# Altium schematic sheet TOP.SchDoc
size A4
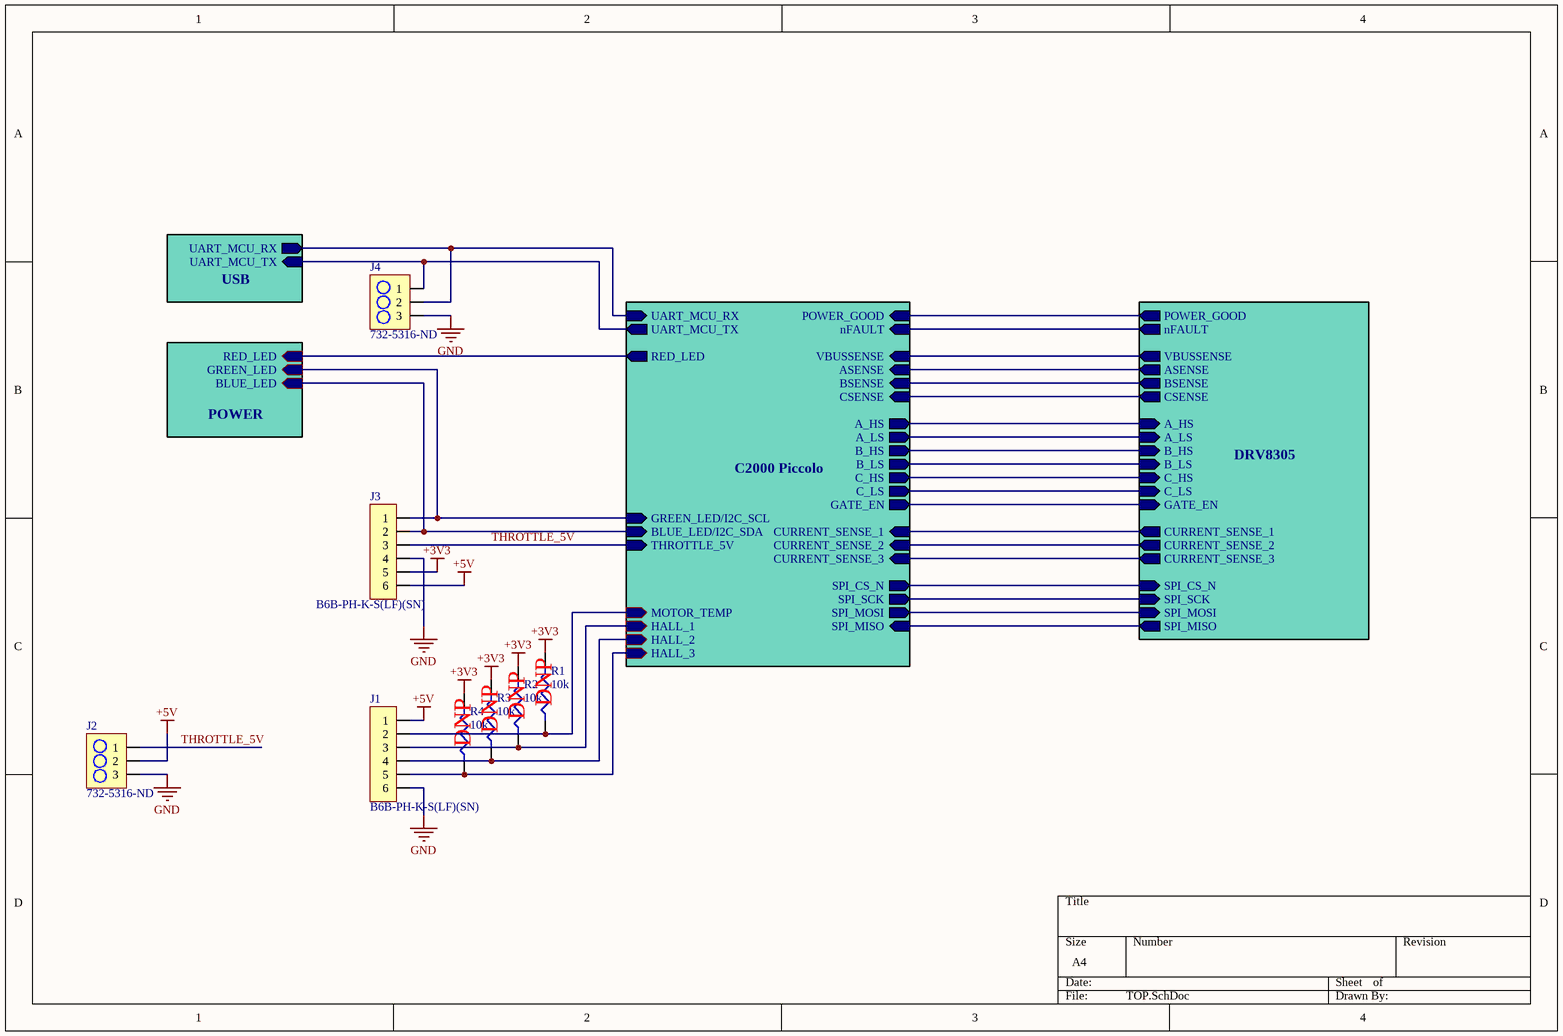
[diagram p0: TOP.SchDoc]

## Parts
J1  B6B-PH-K-S(LF)(SN)  [JST-PH-6]
J2  732-5316-ND  [3PIN_HEADER]
J3  B6B-PH-K-S(LF)(SN)  [JST-PH-6]
J4  732-5316-ND  [3PIN_HEADER]
R1  10k  [R0402]
R2  10k  [R0402]
R3  10k  [R0402]
R4  10k  [R0402]

## Sub-sheets
C2000 Piccolo = MCU.SchDoc: VBUSSENSE, ASENSE, BSENSE, CSENSE, A_HS, A_LS, B_HS, B_LS, C_HS, C_LS, GATE_EN, CURRENT_SENSE_1, CURRENT_SENSE_2, CURRENT_SENSE_3, SPI_CS_N, SPI_SCK, SPI_MOSI, SPI_MISO, POWER_GOOD, nFAULT, UART_MCU_RX, UART_MCU_TX, RED_LED, THROTTLE_5V, HALL_3, HALL_1, HALL_2, MOTOR_TEMP, BLUE_LED/I2C_SDA, GREEN_LED/I2C_SCL
DRV8305 = DRIVER.SchDoc: ASENSE, BSENSE, CSENSE, A_HS, A_LS, B_HS, B_LS, C_HS, C_LS, GATE_EN, SPI_CS_N, SPI_SCK, SPI_MOSI, SPI_MISO, nFAULT, POWER_GOOD, VBUSSENSE, CURRENT_SENSE_1, CURRENT_SENSE_2, CURRENT_SENSE_3
POWER = POWER.SchDoc: GREEN_LED, RED_LED, BLUE_LED
USB = USB.SchDoc: UART_MCU_RX, UART_MCU_TX

## Nets
+3V3: J3.5 R1.2 R2.2 R3.2 R4.2
+5V: J1.1 J2.2 J3.6
GND: J1.6 J2.3 J3.4 J4.3
THROTTLE_5V: J2.1 J3.3 ; sheet C2000 Piccolo/THROTTLE_5V
NetJ1_2: J1.2 R1.1 ; sheet C2000 Piccolo/MOTOR_TEMP
NetJ1_3: J1.3 R2.1 ; sheet C2000 Piccolo/HALL_1
NetJ1_4: J1.4 R3.1 ; sheet C2000 Piccolo/HALL_2
NetJ1_5: J1.5 R4.1 ; sheet C2000 Piccolo/HALL_3
NetJ3_1: J3.1 ; sheet C2000 Piccolo/GREEN_LED/I2C_SCL, sheet POWER/GREEN_LED
NetJ3_2: J3.2 ; sheet C2000 Piccolo/BLUE_LED/I2C_SDA, sheet POWER/BLUE_LED
NetJ4_1: J4.1 ; sheet C2000 Piccolo/UART_MCU_TX, sheet USB/UART_MCU_TX
NetJ4_2: J4.2 ; sheet C2000 Piccolo/UART_MCU_RX, sheet USB/UART_MCU_RX
(unnamed): sheet C2000 Piccolo/VBUSSENSE, sheet DRV8305/VBUSSENSE
(unnamed): sheet C2000 Piccolo/ASENSE, sheet DRV8305/ASENSE
(unnamed): sheet C2000 Piccolo/BSENSE, sheet DRV8305/BSENSE
(unnamed): sheet C2000 Piccolo/CSENSE, sheet DRV8305/CSENSE
(unnamed): sheet C2000 Piccolo/A_HS, sheet DRV8305/A_HS
(unnamed): sheet C2000 Piccolo/A_LS, sheet DRV8305/A_LS
(unnamed): sheet C2000 Piccolo/B_HS, sheet DRV8305/B_HS
(unnamed): sheet C2000 Piccolo/B_LS, sheet DRV8305/B_LS
(unnamed): sheet C2000 Piccolo/C_HS, sheet DRV8305/C_HS
(unnamed): sheet C2000 Piccolo/C_LS, sheet DRV8305/C_LS
(unnamed): sheet C2000 Piccolo/GATE_EN, sheet DRV8305/GATE_EN
(unnamed): sheet C2000 Piccolo/CURRENT_SENSE_1, sheet DRV8305/CURRENT_SENSE_1
(unnamed): sheet C2000 Piccolo/CURRENT_SENSE_2, sheet DRV8305/CURRENT_SENSE_2
(unnamed): sheet C2000 Piccolo/CURRENT_SENSE_3, sheet DRV8305/CURRENT_SENSE_3
(unnamed): sheet C2000 Piccolo/SPI_CS_N, sheet DRV8305/SPI_CS_N
(unnamed): sheet C2000 Piccolo/SPI_SCK, sheet DRV8305/SPI_SCK
(unnamed): sheet C2000 Piccolo/SPI_MOSI, sheet DRV8305/SPI_MOSI
(unnamed): sheet C2000 Piccolo/SPI_MISO, sheet DRV8305/SPI_MISO
(unnamed): sheet C2000 Piccolo/POWER_GOOD, sheet DRV8305/POWER_GOOD
(unnamed): sheet C2000 Piccolo/nFAULT, sheet DRV8305/nFAULT
(unnamed): sheet C2000 Piccolo/RED_LED, sheet POWER/RED_LED

## Notes on the sheet
- (near R2) DNP
- (near R1) DNP
- (near R4) DNP
- (near R3) DNP

## Library data of the parts
J1 J3 = B6B-PH-K-S(LF)(SN): CONN JST PH 6 Positions Header, Shrouded Connector 0.079" (2.00mm) Through Hole Tin; Number of Positions: 6; Connector Type: Male Pin; Contact Resistance: 20mR; Current Rating: 2A; Insulation Resistance: 1MR; Max Voltage Rating (AC): 100V; Gender: Male; Pitch: 2mm; Supplier 1: Digi-Key; Manufacturer: JST; Manufacturer Part Number: B6B-PH-K-S(LF)(SN); Stock 1: 75035; Pricing 1: 1=0.33, 10=0.313, 100=0.2194, 500=0.1881, 1000=0.1567, 5000=0.1344, 10000=0.1254 (USD); Mount: Through Hole; Number of Pins: 6; Contact Plating: Copper,Tin; Colour: Natural; Contact Material: Brass,Tin; Housing Colour: White; Housing Material: Polyamide; Min Operating Temperature: -25°C; Max Operating Temperature: 85°C; Number of Rows: 1; Packaging: Bulk; Max Current Rating: 2A; Termination: Solder; Number of Contacts: 6; Orientation: Straight; Voltage Rating (AC): 100V; Voltage Rating: 100V; Fastening Type: Detent; Working Voltage: 100V; Number of Poles: 6; Length: 13.9mm; Height: 9.4mm; Width: 4.5mm; Depth: 4.5mm; Lead Pitch: 2mm; Contact Mating Length: 0.13inch; Lead Free: Lead Free; REACH SVHC: No SVHC; ComponentLink1URL: https://datasheet.ciiva.com/712/eph-712563.pdf; ComponentLink1Description: https://datasheet.ciiva.com/712/eph-712563.pdf; ComponentLink2URL: https://datasheet.ciiva.com/26894/getdatasheetpartid-639917-26894487.pdf; ComponentLink2Description: https://datasheet.ciiva.com/26894/getdatasheetpartid-639917-26894487.pdf; ComponentLink3URL: https://datasheet.ciiva.com/11747/0900766b8082f554-11747368.pdf; ComponentLink3Description: https://datasheet.ciiva.com/11747/0900766b8082f554-11747368.pdf; ComponentLink4URL: https://datasheet.ciiva.com/20207/523648-20207241.pdf; ComponentLink4Description: https://datasheet.ciiva.com/20207/523648-20207241.pdf; ComponentLink5URL: https://datasheet.ciiva.com/8052/80560-8052027.pdf; ComponentLink5Description: https://datasheet.ciiva.com/8052/80560-8052027.pdf; Supplier Part Number 1: 455-1708-ND
J2 J4 = 61300311121: CONN_HeaderPins3pos WURTH ELEKTRONIK Board-To-Board Connector, Vertical, WR-PHD Series, Through Hole, Header, 3 Contacts, 2.54 mm; Manufacturer: Wurth Electronics; Number of Positions: 3; Gender: Male; Connector Type: Male Pin; Pitch: 0.1inch; Supplier 1: Digi-Key; Manufacturer Part Number: 61300311121; Stock 1: 57026; Pricing 1: 1=0.13, 10=0.106, 25=0.088, 50=0.074, 100=0.067, 1000=0.061 (USD); Mount: Through Hole; Case/Package: 100; Contact Plating: Gold; Contact Material: Copper; Colour: Black; Number of Rows: 1; Packaging: Bulk; Termination: Solder; Number of Contacts: 3; Contact Mating Length: 0.236inch; REACH SVHC: Unknown; Lead Free: Lead Free; ComponentLink1URL: http://www.farnell.com/cad/1737268.pdf; ComponentLink1Description: http://www.farnell.com/cad/1737268.pdf; Supplier Part Number 1: 732-5316-ND
R1-R4 = RC0402JR-0710KL: RES SMD 10K OHM 5% 1/16W 0402; Manufacturer: Yageo; Resistance: 10kR; Power Rating: 62.5mW; Voltage Rating: 50V; Temperature Coefficient: 100ppm/°C; Max Power Dissipation: 63mW; Supplier 1: Digi-Key; Manufacturer Part Number: RC0402JR-0710KL; Stock 1: 47303622; Pricing 1: 1=0.1, 10=0.018, 100=0.0073, 1000=0.0033, 2500=0.0029, 5000=0.0024 (USD); Case/Package: 0402; Case Code (Metric): 1005; Case Code (Imperial): 0402; Min Operating Temperature: -55°C; Max Operating Temperature: 155°C; Packaging: Tape and Reel; Tolerance: 5%; Package Quantity: 1; Composition: Thick Film; Number of Terminations: 2; Termination: SMD/SMT; Military Standard: Not; Features: Moisture Resistant; Length: 1mm; Height: 0.016inch; Width: 0.02inch; Depth: 0.5mm; REACH SVHC: Unknown; Lead Free: Lead Free; Supplier Part Number 1: 311-10KJRCT-ND